# Altium schematic sheet BNO055_Schematic.SchDoc
size A
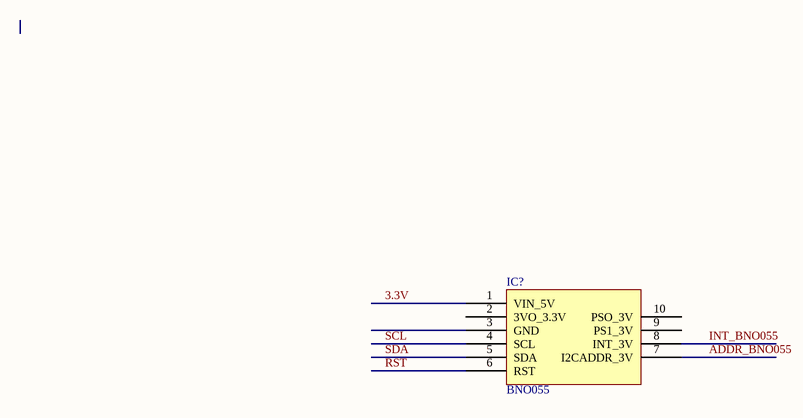
[diagram p0: BNO055_Schematic.SchDoc]

## Parts
IC?  BNO055

## Nets
3.3V: IC?.1(VIN_5V)
ADDR_BNO055: IC?.7(I2CADDR_3V)
INT_BNO055: IC?.8(INT_3V)
RST: IC?.6(RST)
SCL: IC?.4(SCL)
SDA: IC?.5(SDA)

Not connected (* = marked no-connect by the designer): IC? 2(3VO_3.3V) 3(GND) 9(PS1_3V) 10(PSO_3V)